# Altium schematic sheet Temperature Sensor Card Analog.SchDoc: Analog Temperature Sensor
size A4
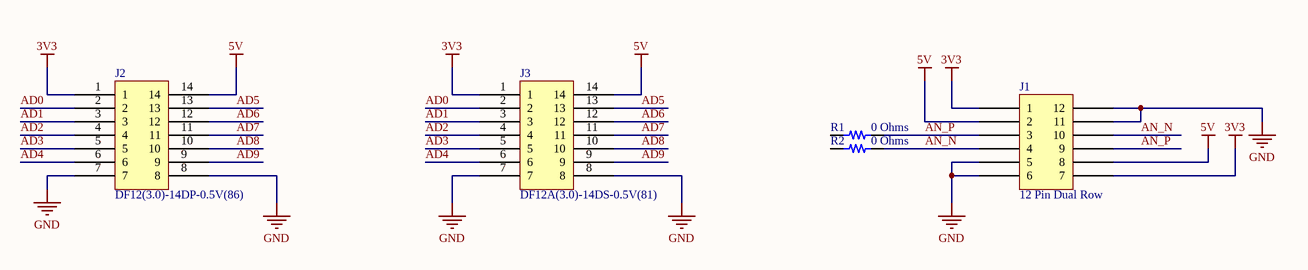
[diagram p0: Temperature Sensor Card Analog.SchDoc]

## Parts
J1  12 Pin Dual Row  [TE 5650118-3 Card Edge]
J2  DF12(3.0)-14DP-0.5V(86)  [HIROSE DF12 3.0-14DP-0.5V 86]
J3  DF12A(3.0)-14DS-0.5V(81)  [HIROSE DF12A 3.0-14DS-0.5V 81]
R1  0 Ohms  [RES 0603_1608]
R2  0 Ohms  [RES 0603_1608]

## Nets
3V3: J1.1 J1.7 J2.1 J3.1
5V: J1.2 J1.8 J2.14 J3.14
GND: J1.5 J1.6 J1.11 J1.12 J2.7 J2.8 J3.7 J3.8
AD0: J2.2 J3.2
AD1: J2.3 J3.3
AD2: J2.4 J3.4
AD3: J2.5 J3.5
AD4: J2.6 J3.6
AD5: J2.13 J3.13
AD6: J2.12 J3.12
AD7: J2.11 J3.11
AD8: J2.10 J3.10
AD9: J2.9 J3.9
AN_N: J1.4 J1.10 R2.2
AN_P: J1.3 J1.9 R1.2

Not connected (* = marked no-connect by the designer): R1 1; R2 1

## Notes on the sheet
- Title
- Size:
- Date:
- A4
- Number:
- Time:
- Revision:
- Sheet
- of
- File:

## Library data of the parts
J2 = DF12(3.0)-14DP-0.5V(86): CONN HDR 14POS SMD GOLD; Manufacturer: Hirose Electric Co Ltd; Connector Type: Header, Outer Shroud Contacts; Mated Stacking Heights: 3mm; Number of Positions: 14; Pitch: 0.020" (0.50mm); Part Number: DF12(3.0)-14DP-0.5V(86); ComponentLink1Description: Datasheet; ComponentLink1URL: https://www.hirose.com/product/download/?distributor=digikey&type=specSheet&lang=en&num=DF12(3.0)-14DP-0.5V(86); ComponentLink2Description: DigiKey Link; ComponentLink2URL: http://digikey.com/product-detail/en/hirose-electric-co-ltd/DF12-3.0-14DP-0.5V-86/H11701CT-ND/2172493; Contact Finish: Gold; Contact Finish Thickness: 8.00µin (0.203µm); Features: Board Guide, Solder Retention; Height Above Board: 0.091" (2.30mm); LastUpdated: 06/08/2020 22:47:47; Lifecycle Status: Active; Minimum Order: 1; Mounting Type: Surface Mount; Number of Rows: 2; Packaging: TapeAndReel; Part Status: Active; Price: 0.38; Series: DF12; Supplier 1: DigiKey; Supplier Part Number 1: H11701CT-ND
J3 = DF12A(3.0)-14DS-0.5V(81): CONN RCPT 14POS SMD GOLD; Manufacturer: Hirose Electric Co Ltd; Connector Type: Receptacle, Center Strip Contacts; Mated Stacking Heights: 3mm; Number of Positions: 14; Pitch: 0.020" (0.50mm); Part Number: DF12A(3.0)-14DS-0.5V(81); ComponentLink1Description: Datasheet; ComponentLink1URL: https://www.hirose.com/product/document?clcode=CL0537-0721-0-86&productname=DF12(3.0)-10DP-0.5V(86)&series=DF12&documenttype=Catalog&lang=en&documentid=D31693_en; ComponentLink2Description: DigiKey Link; ComponentLink2URL: http://digikey.com/product-detail/en/hirose-electric-co-ltd/DF12A-3.0-14DS-0.5V-81/H11713CT-ND/2172505; Contact Finish: Gold; Contact Finish Thickness: 8.00µin (0.203µm); Features: Board Guide; Height Above Board: 0.087" (2.20mm); LastUpdated: 06/08/2020 22:48:47; Lifecycle Status: Active; Minimum Order: 1; Mounting Type: Surface Mount; Number of Rows: 2; Packaging: TapeAndReel; Part Status: Active; Price: 0.36; Series: DF12; Supplier 1: DigiKey; Supplier Part Number 1: H11713CT-ND
R1 R2 = ERJ-3GEY0R00V: RES SMD 0 OHM JUMPER 1/10W 0603; Manufacturer: Panasonic Electronic Components; Power (Watts): 0.1W, 1/10W; Part Number: ERJ-3GEY0R00V; Value: 0 Ohms; ComponentLink1Description: Datasheet; ComponentLink1URL: http://industrial.panasonic.com/www-cgi/jvcr13pz.cgi?E+PZ+3+AOA0001+ERJ3GEY0R00V+7+WW; ComponentLink2Description: DigiKey Link; ComponentLink2URL: http://digikey.com/product-detail/en/panasonic-electronic-components/ERJ-3GEY0R00V/P0.0GCT-ND/134711; Composition: Thick Film; Device Package: 0603 (1608 Metric); Features: Automotive AEC-Q200; Height - Seated (Max): 0.022" (0.55mm); LastUpdated: 13/08/2020 10:36:40; Lifecycle Status: Active; Minimum Order: 1; Number of Terminations: 2; Operating Temperature: -55°C ~ 155°C; Package / Case: 0603 (1608 Metric); Packaging: CutTape; PartId: 22603; Part Status: Active; Price: 0.10; Ratings: AEC-Q200; Resistance: 0 Ohms; Series: ERJ; Size / Dimension: 0.063" L x 0.031" W (1.60mm x 0.80mm); Supplier 1: DigiKey; Supplier Part Number 1: P0.0GCT-ND; Supplier Device Package: 0603; Tolerance: Jumper